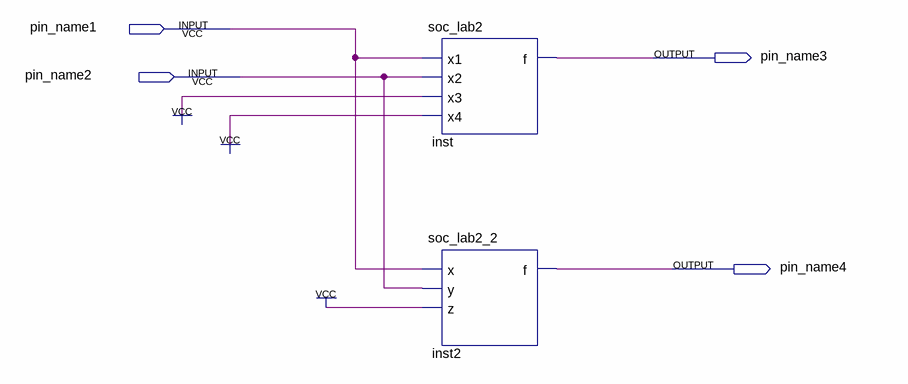
[diagram p0: schematic sheet]
// Quartus schematic block1.bdf as structural Verilog: 2 symbols, 4 pins
module block1 (
  input  pin_name1,
  input  pin_name2,
  output pin_name3,
  output pin_name4
);

  soc_lab2 inst (.x1(pin_name1), .x2(pin_name2), .x3(1'b1), .x4(1'b1), .f(pin_name3));
  soc_lab2_2 inst2 (.x(pin_name1), .y(pin_name2), .z(1'b1), .f(pin_name4));
endmodule
